# Altium schematic sheet network.SCHDOC
size B
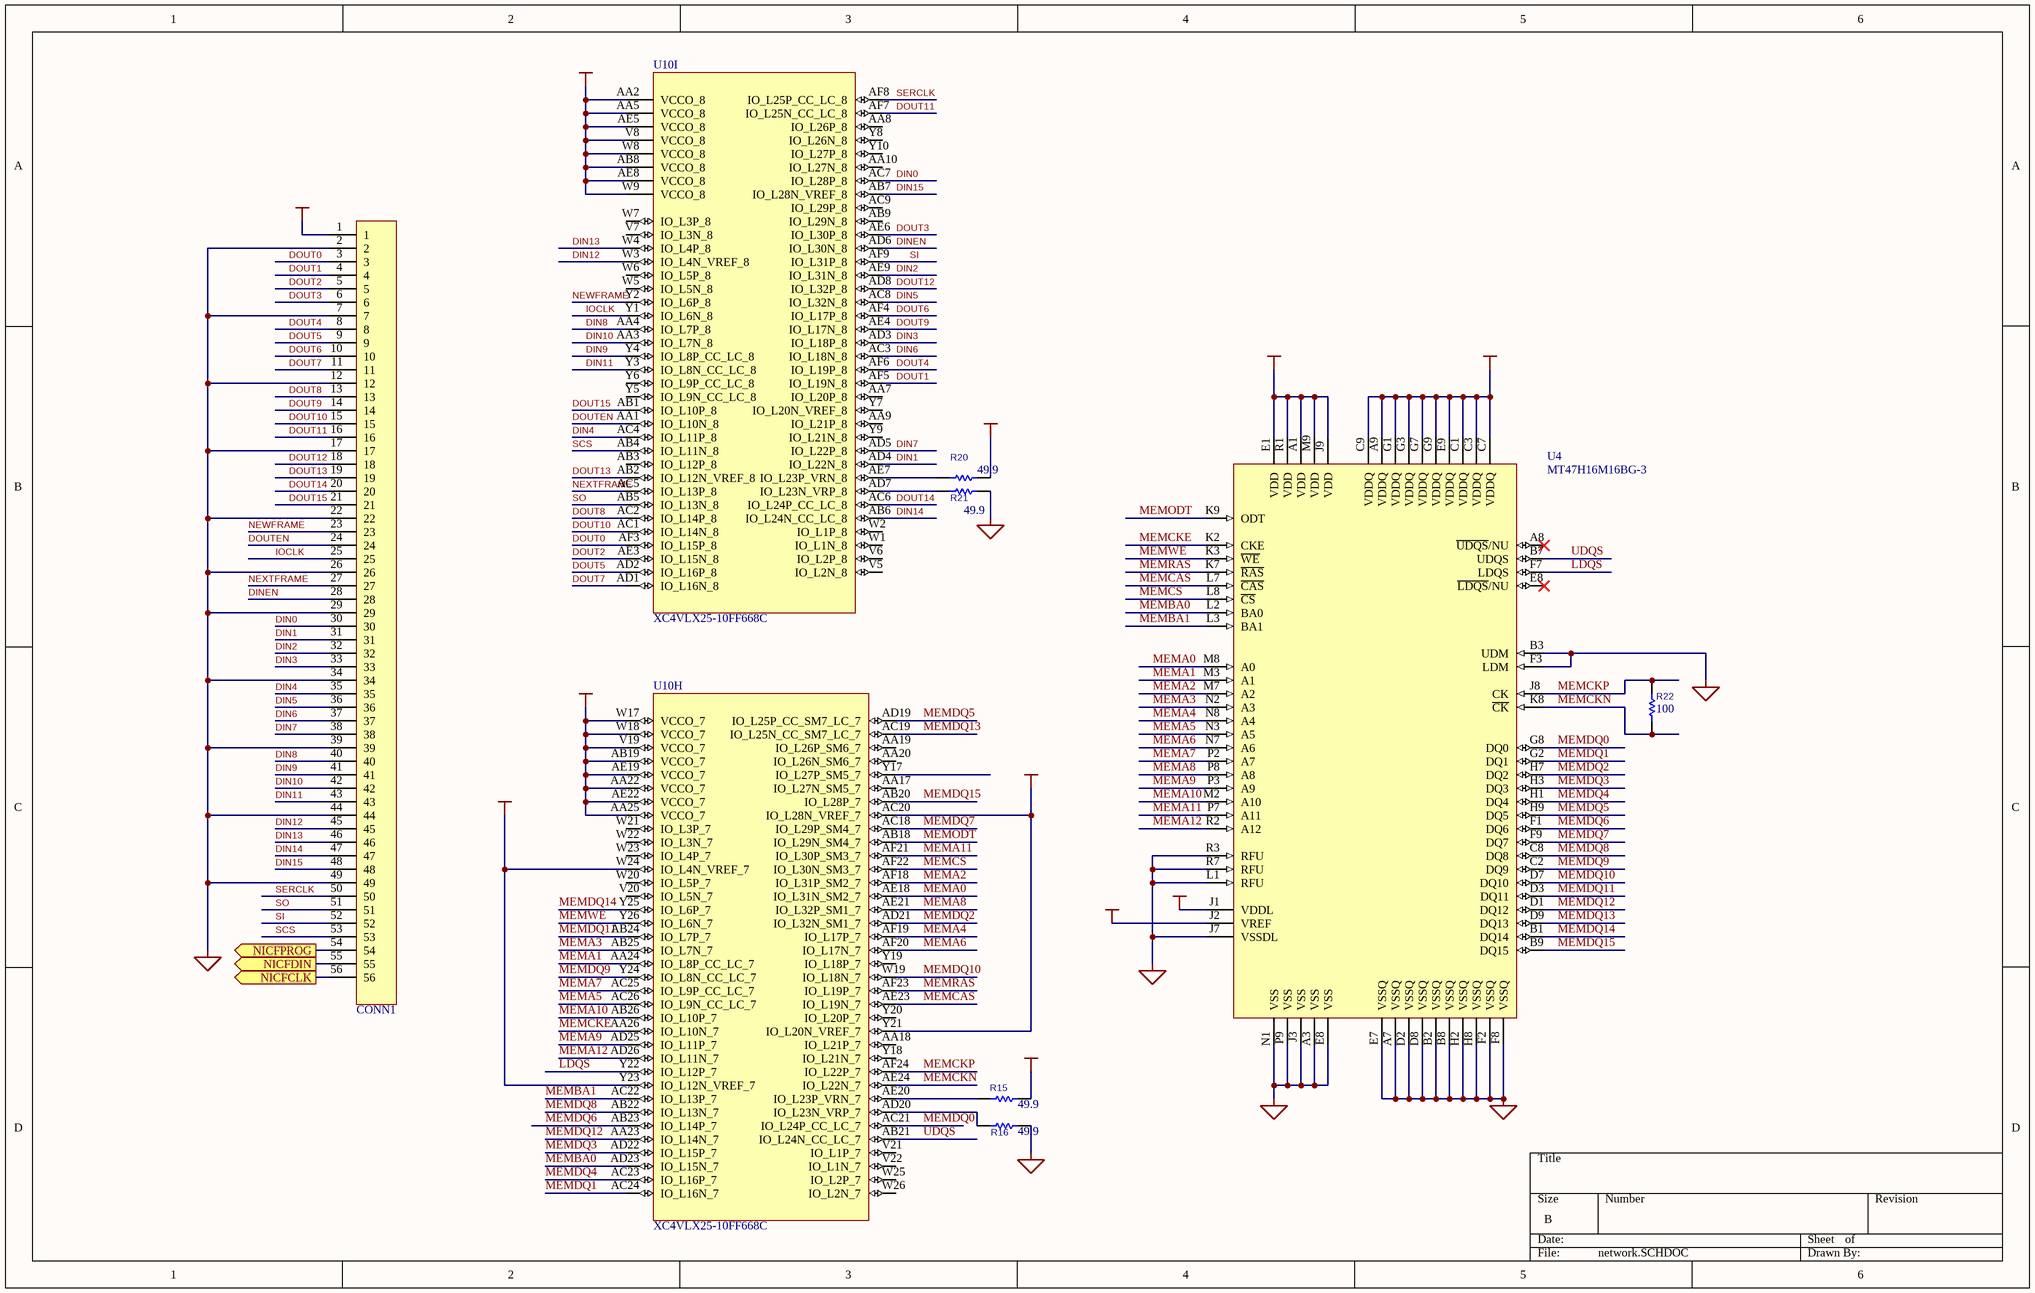
[diagram p0: network.SCHDOC]

## Parts
CONN1  CON56B  [HDR56]  (value not drawn)
R15  value 49.9  [0402]  (hidden comment: 50)
R16  value 49.9  [0402]  (hidden comment: 50)
R20  value 49.9  [0402]  (hidden comment: 50)
R21  value 49.9  [0402]  (hidden comment: 50)
R22  value 100  [0402]  (hidden comment: 50)
U4  MT47H16M16BG-3  [MICRON84FBGA]
U10  XC4VLX25-10FF668C  [Xilinx FF668]  (parts H,I of 13)

## Ports
NICFCLK (out), NICFDIN (out), NICFPROG (out)

## Nets
3.3VCC: R20.1
+0.9VCC: U4.J2(VREF) U10.AC20(IO_L28N_VREF_7) U10.W24(IO_L4N_VREF_7) U10.Y21(IO_L20N_VREF_7) U10.Y23(IO_L12N_VREF_7)
+1.8VCC: R15.1 U4.A1(VDD) U4.A9(VDDQ) U4.C1(VDDQ) U4.C3(VDDQ) U4.C7(VDDQ) U4.C9(VDDQ) U4.E1(VDD) U4.E9(VDDQ) U4.G1(VDDQ) U4.G3(VDDQ) U4.G7(VDDQ) U4.G9(VDDQ) U4.J1(VDDL) U4.J9(VDD) U4.M9(VDD) U4.R1(VDD) U10.AA22(VCCO_7) U10.AA25(VCCO_7) U10.AB19(VCCO_7) U10.AE19(VCCO_7) U10.AE22(VCCO_7) U10.V19(VCCO_7) U10.W17(VCCO_7) U10.W18(VCCO_7)
GND: CONN1.2 CONN1.7 CONN1.12 CONN1.17 CONN1.22 CONN1.26 CONN1.29 CONN1.34 CONN1.39 CONN1.44 CONN1.49 R16.1 R21.1 U4.A3(VSS) U4.A7(VSSQ) U4.B2(VSSQ) U4.B3(UDM) U4.B8(VSSQ) U4.D2(VSSQ) U4.D8(VSSQ) U4.E7(VSSQ) U4.E8(VSS) U4.F2(VSSQ) U4.F3(LDM) U4.F8(VSSQ) U4.H2(VSSQ) U4.H8(VSSQ) U4.J3(VSS) U4.J7(VSSDL) U4.L1(RFU) U4.N1(VSS) U4.P9(VSS) U4.R3(RFU) U4.R7(RFU)
VCC: CONN1.1 U10.AA2(VCCO_8) U10.AA5(VCCO_8) U10.AB8(VCCO_8) U10.AE5(VCCO_8) U10.AE8(VCCO_8) U10.V8(VCCO_8) U10.W8(VCCO_8) U10.W9(VCCO_8)
DIN0: CONN1.30 U10.AC7(IO_L28P_8)
DIN1: CONN1.31 U10.AD4(IO_L22N_8)
DIN2: CONN1.32 U10.AE9(IO_L31N_8)
DIN3: CONN1.33 U10.AD3(IO_L18P_8)
DIN4: CONN1.35 U10.AC4(IO_L11P_8)
DIN5: CONN1.36 U10.AC8(IO_L32N_8)
DIN6: CONN1.37 U10.AC3(IO_L18N_8)
DIN7: CONN1.38 U10.AD5(IO_L22P_8)
DIN8: CONN1.40 U10.AA4(IO_L7P_8)
DIN9: CONN1.41 U10.Y4(IO_L8P_CC_LC_8)
DIN10: CONN1.42 U10.AA3(IO_L7N_8)
DIN11: CONN1.43 U10.Y3(IO_L8N_CC_LC_8)
DIN12: CONN1.45 U10.W3(IO_L4N_VREF_8)
DIN13: CONN1.46 U10.W4(IO_L4P_8)
DIN14: CONN1.47 U10.AB6(IO_L24N_CC_LC_8)
DIN15: CONN1.48 U10.AB7(IO_L28N_VREF_8)
DINEN: CONN1.28 U10.AD6(IO_L30N_8)
DOUT0: CONN1.3 U10.AF3(IO_L15P_8)
DOUT1: CONN1.4 U10.AF5(IO_L19N_8)
DOUT2: CONN1.5 U10.AE3(IO_L15N_8)
DOUT3: CONN1.6 U10.AE6(IO_L30P_8)
DOUT4: CONN1.8 U10.AF6(IO_L19P_8)
DOUT5: CONN1.9 U10.AD2(IO_L16P_8)
DOUT6: CONN1.10 U10.AF4(IO_L17P_8)
DOUT7: CONN1.11 U10.AD1(IO_L16N_8)
DOUT8: CONN1.13 U10.AC2(IO_L14P_8)
DOUT9: CONN1.14 U10.AE4(IO_L17N_8)
DOUT10: CONN1.15 U10.AC1(IO_L14N_8)
DOUT11: CONN1.16 U10.AF7(IO_L25N_CC_LC_8)
DOUT12: CONN1.18 U10.AD8(IO_L32P_8)
DOUT13: CONN1.19 U10.AB2(IO_L12N_VREF_8)
DOUT14: CONN1.20 U10.AC6(IO_L24P_CC_LC_8)
DOUT15: CONN1.21 U10.AB1(IO_L10P_8)
DOUTEN: CONN1.24 U10.AA1(IO_L10N_8)
IOCLK: CONN1.25 U10.Y1(IO_L6N_8)
LDQS: U4.F7(LDQS) U10.Y22(IO_L12P_7)
MEMA0: U4.M8(A0) U10.AE18(IO_L31N_SM2_7)
MEMA1: U4.M3(A1) U10.AA24(IO_L8P_CC_LC_7)
MEMA2: U4.M7(A2) U10.AF18(IO_L31P_SM2_7)
MEMA3: U4.N2(A3) U10.AB25(IO_L7N_7)
MEMA4: U4.N8(A4) U10.AF19(IO_L17P_7)
MEMA5: U4.N3(A5) U10.AC26(IO_L9N_CC_LC_7)
MEMA6: U4.N7(A6) U10.AF20(IO_L17N_7)
MEMA7: U4.P2(A7) U10.AC25(IO_L9P_CC_LC_7)
MEMA8: U4.P8(A8) U10.AE21(IO_L32P_SM1_7)
MEMA9: U4.P3(A9) U10.AD25(IO_L11P_7)
MEMA10: U4.M2(A10) U10.AB26(IO_L10P_7)
MEMA11: U4.P7(A11) U10.AF21(IO_L30P_SM3_7)
MEMA12: U4.R2(A12) U10.AD26(IO_L11N_7)
MEMBA0: U4.L2(BA0) U10.AD23(IO_L15N_7)
MEMBA1: U4.L3(BA1) U10.AC22(IO_L13P_7)
MEM~{CAS}: U4.L7(~{CAS}) U10.AE23(IO_L19N_7)
MEM~{CS}: U4.L8(~{CS}) U10.AF22(IO_L30N_SM3_7)
MEMCKE: U4.K2(CKE) U10.AA26(IO_L10N_7)
MEMCKN: R22.2 U4.K8(~{CK}) U10.AE24(IO_L22N_7)
MEMCKP: R22.1 U4.J8(CK) U10.AF24(IO_L22P_7)
MEMDQ0: U4.G8(DQ0) U10.AC21(IO_L24P_CC_LC_7)
MEMDQ1: U4.G2(DQ1) U10.AC24(IO_L16N_7)
MEMDQ2: U4.H7(DQ2) U10.AD21(IO_L32N_SM1_7)
MEMDQ3: U4.H3(DQ3) U10.AD22(IO_L15P_7)
MEMDQ4: U4.H1(DQ4) U10.AC23(IO_L16P_7)
MEMDQ5: U4.H9(DQ5) U10.AD19(IO_L25P_CC_SM7_LC_7)
MEMDQ6: U4.F1(DQ6) U10.AB23(IO_L14P_7)
MEMDQ7: U4.F9(DQ7) U10.AC18(IO_L29P_SM4_7)
MEMDQ8: U4.C8(DQ8) U10.AB22(IO_L13N_7)
MEMDQ9: U4.C2(DQ9) U10.Y24(IO_L8N_CC_LC_7)
MEMDQ10: U4.D7(DQ10) U10.W19(IO_L18N_7)
MEMDQ11: U4.D3(DQ11) U10.AB24(IO_L7P_7)
MEMDQ12: U4.D1(DQ12) U10.AA23(IO_L14N_7)
MEMDQ13: U4.D9(DQ13) U10.AC19(IO_L25N_CC_SM7_LC_7)
MEMDQ14: U4.B1(DQ14) U10.Y25(IO_L6P_7)
MEMDQ15: U4.B9(DQ15) U10.AB20(IO_L28P_7)
MEMODT: U4.K9(ODT) U10.AB18(IO_L29N_SM4_7)
MEM~{RAS}: U4.K7(~{RAS}) U10.AF23(IO_L19P_7)
MEM~{WE}: U4.K3(~{WE}) U10.Y26(IO_L6N_7)
NEWFRAME: CONN1.23 U10.Y2(IO_L6P_8)
NEXTFRAME: CONN1.27 U10.AC5(IO_L13P_8)
NICFCLK: CONN1.56 ; port NICFCLK
NICFDIN: CONN1.55 ; port NICFDIN
NICFPROG: CONN1.54 ; port NICFPROG
SCS: CONN1.53 U10.AB4(IO_L11N_8)
SERCLK: CONN1.50 U10.AF8(IO_L25P_CC_LC_8)
SI: CONN1.52 U10.AF9(IO_L31P_8)
SO: CONN1.51 U10.AB5(IO_L13N_8)
UDQS: U4.B7(UDQS) U10.AB21(IO_L24N_CC_LC_7)
NetR15_2: R15.2 U10.AE20(IO_L23P_VRN_7)
NetR16_2: R16.2 U10.AD20(IO_L23N_VRP_7)
NetR20_2: R20.2 U10.AE7(IO_L23P_VRN_8)
NetR21_2: R21.2 U10.AD7(IO_L23N_VRP_8)

Not connected (* = marked no-connect by the designer): U4 A8(~{UDQS}/NU)*; U10 AA7(IO_L20P_8) AA8(IO_L26P_8) AA9(IO_L21P_8) AA10(IO_L27N_8) AA17(IO_L27N_SM5_7) AA18(IO_L21P_7) AA19(IO_L26P_SM6_7) AA20(IO_L26N_SM6_7) AB3(IO_L12P_8) AB9(IO_L29N_8) AC9(IO_L29P_8) V5(IO_L2N_8) V6(IO_L2P_8) V7(IO_L3N_8) V20(IO_L5N_7) V21(IO_L1P_7) V22(IO_L1N_7) W1(IO_L1N_8) W2(IO_L1P_8) W5(IO_L5N_8) W6(IO_L5P_8) W7(IO_L3P_8) W20(IO_L5P_7) W21(IO_L3P_7) W22(IO_L3N_7) W23(IO_L4P_7) W25(IO_L2P_7) W26(IO_L2N_7) Y5(IO_L9N_CC_LC_8) Y6(IO_L9P_CC_LC_8) Y7(IO_L20N_VREF_8) Y8(IO_L26N_8) Y9(IO_L21N_8) Y10(IO_L27P_8) Y17(IO_L27P_SM5_7) Y18(IO_L21N_7) Y19(IO_L18P_7) Y20(IO_L20P_7)

## Library data of the parts
R15 R16 R20-R22 = RESISTOR: Standard Passive Resistor; 50: Value; Tolerance: 1%
U4 = MT47H16M16BG-3: Micron DDR2 SDRAM
U10 = XC4VLX25-10FF668C: Xilinx Virtex-4